# Altium project Power Distribution Unit 2019.PrjPCB (part 2 of 2)

## Sheet LowCurrentSwitches.SchDoc
size A4
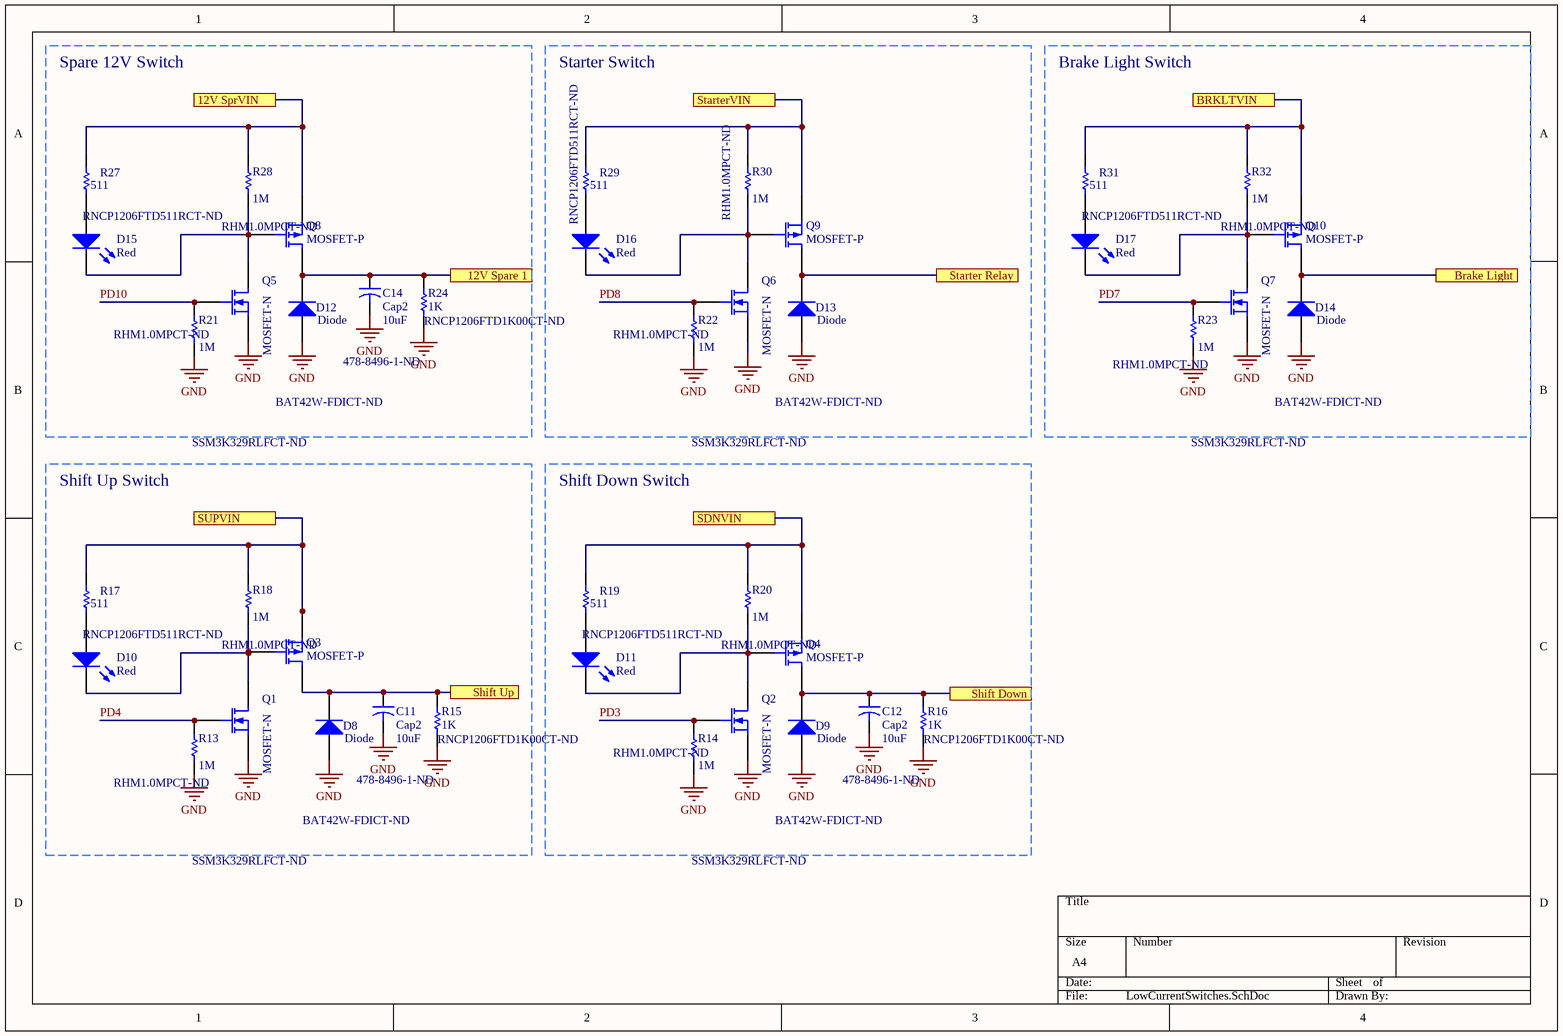
[diagram p2: LowCurrentSwitches.SchDoc]

### Parts
C11  Cap2  value 10uF  Supplier Part Number: 478-8496-1-ND  [PolCap1206]
C12  Cap2  value 10uF  Supplier Part Number: 478-8496-1-ND  [PolCap1206]
C14  Cap2  value 10uF  Supplier Part Number: 478-8496-1-ND  [PolCap1206]
D8  Diode  Supplier Part Number: BAT42W-FDICT-ND  [SOD123]
D9  Diode  Supplier Part Number: BAT42W-FDICT-ND  [SOD123]
D10  Red  [LEDC3216X120NRED]
D11  Red  [LEDC3216X120NRED]
D12  Diode  Supplier Part Number: BAT42W-FDICT-ND  [SOD123]
D13  Diode  Supplier Part Number: BAT42W-FDICT-ND  [SOD123]
D14  Diode  Supplier Part Number: BAT42W-FDICT-ND  [SOD123]
D15  Red  [LEDC3216X120NRED]
D16  Red  [LEDC3216X120NRED]
D17  Red  [LEDC3216X120NRED]
Q1  MOSFET-N  Supplier Part Number: SSM3K329RLFCT-ND  [SOT23-3]
Q2  MOSFET-N  Supplier Part Number: SSM3K329RLFCT-ND  [SOT23-3]
Q3  MOSFET-P  [SOT23-3]
Q4  MOSFET-P  [SOT23-3]
Q5  MOSFET-N  Supplier Part Number: SSM3K329RLFCT-ND  [SOT23-3]
Q6  MOSFET-N  Supplier Part Number: SSM3K329RLFCT-ND  [SOT23-3]
Q7  MOSFET-N  Supplier Part Number: SSM3K329RLFCT-ND  [SOT23-3]
Q8  MOSFET-P  [SOT23-3]
Q9  MOSFET-P  [SOT23-3]
Q10  MOSFET-P  [SOT23-3]
R13  value 1M  Supplier Part Number: RHM1.0MPCT-ND  [RESC3216X60N]  (hidden comment: 1206)
R14  value 1M  Supplier Part Number 1: RHM1.0MPCT-ND  [RESC3216X60N]  (hidden comment: 1206)
R15  1K  Supplier Part Number: RNCP1206FTD1K00CT-ND  [RESC3216X60N]
R16  1K  Supplier Part Number: RNCP1206FTD1K00CT-ND  [RESC3216X60N]
R17  511  Supplier Part Number: RNCP1206FTD511RCT-ND  [RESC3216X60N]
R18  value 1M  Supplier Part Number: RHM1.0MPCT-ND  [RESC3216X60N]  (hidden comment: 1206)
R19  511  Supplier Part Number: RNCP1206FTD511RCT-ND  [RESC3216X60N]
R20  value 1M  Supplier Part Number: RHM1.0MPCT-ND  [RESC3216X60N]  (hidden comment: 1206)
R21  value 1M  Supplier Part Number 1: RHM1.0MPCT-ND  [RESC3216X60N]  (hidden comment: 1206)
R22  value 1M  Supplier Part Number 1: RHM1.0MPCT-ND  [RESC3216X60N]  (hidden comment: 1206)
R23  value 1M  Supplier Part Number: RHM1.0MPCT-ND  [RESC3216X60N]  (hidden comment: 1206)
R24  1K  Supplier Part Number: RNCP1206FTD1K00CT-ND  [RESC3216X60N]
R27  511  Supplier Part Number: RNCP1206FTD511RCT-ND  [RESC3216X60N]
R28  value 1M  Supplier Part Number: RHM1.0MPCT-ND  [RESC3216X60N]  (hidden comment: 1206)
R29  511  Supplier Part Number: RNCP1206FTD511RCT-ND  [RESC3216X60N]
R30  value 1M  Supplier Part Number 1: RHM1.0MPCT-ND  [RESC3216X60N]  (hidden comment: 1206)
R31  511  Supplier Part Number: RNCP1206FTD511RCT-ND  [RESC3216X60N]
R32  value 1M  Supplier Part Number: RHM1.0MPCT-ND  [RESC3216X60N]  (hidden comment: 1206)

### Blocks framed on the sheet
Spare 12V Switch: C14 D12 D15 Q5 Q8 R21 R24 R27 R28
Starter Switch: D13 D16 Q6 Q9 R22 R29 R30
Brake Light Switch: D14 D17 Q7 Q10 R23 R31 R32
Shift Up Switch: C11 D8 D10 Q1 Q3 R13 R15 R17 R18
Shift Down Switch: C12 D9 D11 Q2 Q4 R14 R16 R19 R20

### Ports
12V Spare 1, 12V SprVIN, Brake Light, BRKLTVIN, SDNVIN, Shift Down, Shift Up, Starter Relay, StarterVIN, SUPVIN

### Nets
GND: C11.2 C12.2 C14.2 D8.1(A) D9.1(A) D12.1(A) D13.1(A) D14.1(A) Q1.3(S) Q2.3(S) Q5.3(S) Q6.3(S) Q7.3(S) R13.1 R14.1 R15.1 R16.1 R21.1 R22.1 R23.1 R24.1
PD3: Q2.2(G) R14.2
PD4: Q1.2(G) R13.2
PD7: Q7.2(G) R23.2
PD8: Q6.2(G) R22.2
PD10: Q5.2(G) R21.2
Net12VSpr1_1: Q8.3(S) R27.1 R28.2 ; port 12V SprVIN
NetBRKLTVIN_1: Q10.3(S) R31.1 R32.2 ; port BRKLTVIN
NetC11_1: C11.1 D8.2(K) Q3.1(D) R15.2 ; port Shift Up
NetC12_1: C12.1 D9.2(K) Q4.1(D) R16.2 ; port Shift Down
NetC14_1: C14.1 D12.2(K) Q8.1(D) R24.2 ; port 12V Spare 1
NetD10_1: D10.1(A) R17.2
NetD10_2: D10.2(K) Q1.1(D) Q3.2(G) R18.1
NetD11_1: D11.1(A) R19.2
NetD11_2: D11.2(K) Q2.1(D) Q4.2(G) R20.1
NetD13_2: D13.2(K) Q9.1(D) ; port Starter Relay
NetD14_2: D14.2(K) Q10.1(D) ; port Brake Light
NetD15_1: D15.1(A) R27.2
NetD15_2: D15.2(K) Q5.1(D) Q8.2(G) R28.1
NetD16_1: D16.1(A) R29.2
NetD16_2: D16.2(K) Q6.1(D) Q9.2(G) R30.1
NetD17_1: D17.1(A) R31.2
NetD17_2: D17.2(K) Q7.1(D) Q10.2(G) R32.1
NetQ3_3: Q3.3(S) Q4.3(S) R17.1 R18.2 R19.1 R20.2 ; port SUPVIN, port SDNVIN
NetQ9_3: Q9.3(S) R29.1 R30.2 ; port StarterVIN

### Library data of the parts
C11 C12 C14 = Cap2: Capacitor. Ceramic 10uF 50V rating recommended, place close to pin; Published: 23-Sep-2002; PackageReference: CAPR5-4X5; Publisher: Altium Limited; PackageDescription: Capacitor; 2 Leads; Supplier 1: Digi-Key
D8 D9 D12-D14 = Diode: Default Diode; Published: 8-Jun-2000; LatestRevisionDate: 17-Jul-2002; LatestRevisionNote: Re-released for DXP Platform.; PackageVersion: Sep-1996; PackageReference: SMC; Publisher: Altium Limited; PackageDescription: DO-214-AB/SMC; 2 C-Bend Leads; Body 7.9 x 5.9 mm, inc. leads (LxW); Code_JEDEC: DO-214-AB; Supplier 1: Digi-Key
D10 D11 D15-D17 = LED2_2: Typical RED, GREEN, YELLOW, AMBER GaAs LED; Manufacturer: Broadcom Avago; Manufacturer Part Number: HSMY-C150; Lens Colour: White,Clear; Viewing Angle: 170°; Lens Style: Diffused,Colorless,Rectangular; Wavelength: 586nm; Luminous Intensity: 8mcd; Forward Current: 20mA; Forward Voltage: 2.1V; Number of LEDs: 1; Reverse Voltage: 5V; Power Dissipation: 65mW; Lens Transparency: Diffused; Published: 8-Jun-2000; LatestRevisionDate: 17-Jul-2002; LatestRevisionNote: Re-released for DXP Platform.; PackageVersion: Feb-2002; PackageReference: 3.2X1.6X1.1; Publisher: Altium Limited; PackageDescription: SM LED; 2 Flat Leads; Supplier 1: Digi-Key; Stock 1: 0; Mount: Surface Mount; Case/Package: 1206; Number of Pins: 2; Colour: Red; Case Code (Metric): 3216; Case Code (Imperial): 1206; Contact Plating: Gold; Min Operating Temperature: -40°C; Max Operating Temperature: 85°C; Packaging: Tape and Reel; Package Quantity: 1; Illumination Colour: Red; Dominant Wavelength: 586nm; Test Current: 20mA; Number of Elements: 1; Power Rating: 65mW; Max Power Dissipation: 65mW; Voltage Rating (DC): 2.1V; Length: 3.2mm; Height: 1.1mm; Width: 1.6mm; Depth: 1.6mm; Radiation Hardening: No; REACH SVHC: No SVHC; Lead Free: Lead Free; ComponentLink1URL: https://datasheet.ciiva.com/15117/getdatasheetpartid-110528-15117488.pdf; ComponentLink1Description: https://datasheet.ciiva.com/15117/getdatasheetpartid-110528-15117488.pdf; ComponentLink2URL: https://datasheet.ciiva.com/11774/0900766b804a6539-11774578.pdf; ComponentLink2Description: https://datasheet.ciiva.com/11774/0900766b804a6539-11774578.pdf; ComponentLink3URL: https://datasheet.ciiva.com/19466/1557071-19466435.pdf; ComponentLink3Description: https://datasheet.ciiva.com/19466/1557071-19466435.pdf; ComponentLink4URL: https://datasheet.ciiva.com/14172/swseriehsmx-c150toc190-e-14172159.pdf; ComponentLink4Description: https://datasheet.ciiva.com/14172/swseriehsmx-c150toc190-e-14172159.pdf; ComponentLink5URL: https://datasheet.ciiva.com/29280/180507-da-01-en-chip-led-hsmy-c150-gelb-29280997.pdf; ComponentLink5Description: https://datasheet.ciiva.com/29280/180507-da-01-en-chip-led-hsmy-c150-gelb-29280997.pdf; Supplier 2: Digi-Key; Stock 2: 0; ComponentLink6URL: https://datasheet.ciiva.com/11773/0900766b804a6539-11773956.pdf; ComponentLink6Description: https://datasheet.ciiva.com/11773/0900766b804a6539-11773956.pdf; ComponentLink7URL: https://datasheet.ciiva.com/15117/getdatasheetpartid-142358-15117749.pdf; ComponentLink7Description: https://datasheet.ciiva.com/15117/getdatasheetpartid-142358-15117749.pdf; ComponentLink8URL: https://datasheet.ciiva.com/46426/313031-46426533.pdf; ComponentLink8Description: https://datasheet.ciiva.com/46426/313031-46426533.pdf; ComponentLink9URL: https://datasheet.ciiva.com/14172/swseriehsmx-c150toc190-e-14172156.pdf; ComponentLink9Description: https://datasheet.ciiva.com/14172/swseriehsmx-c150toc190-e-14172156.pdf; ComponentLink10URL: https://datasheet.ciiva.com/29281/180509-da-01-en-chip-led-hsmh-c150-rot-29281009.pdf; ComponentLink10Description: https://datasheet.ciiva.com/29281/180509-da-01-en-chip-led-hsmh-c150-rot-29281009.pdf; Supplier 3: Digi-Key; Supplier 4: Digi-Key; Supplier Part Number: 732-4992-1-ND
Q1 Q2 Q5-Q7 = MOSFET-N: N-Channel MOSFET; Published: 8-Jun-2000; LatestRevisionDate: 17-Jul-2002; LatestRevisionNote: Re-released for DXP Platform.; PackageVersion: 1995/1996; PackageReference: E3; Publisher: Altium Limited; PackageDescription: TO, Flat Index; 3 In-Line, Axial Leads; Body Dia. 4.6mm; Lead Dia. 0.5 mm (max); Supplier 1: Digi-Key
Q3 Q4 Q8-Q10 = MOSFET-P: P-Channel MOSFET; Published: 8-Jun-2000; LatestRevisionDate: 17-Jul-2002; LatestRevisionNote: Re-released for DXP Platform.; PackageVersion: 1995/1996; PackageReference: E3; Publisher: Altium Limited; PackageDescription: TO, Flat Index; 3 In-Line, Axial Leads; Body Dia. 4.6mm; Lead Dia. 0.5 mm (max); Supplier 1: Digi-Key; Supplier Part Number: DMP3099L-7DICT-ND
R13 R14 R17-R23 R27-R32 = Res1: Resistor; Published: 8-Jun-2000; LatestRevisionDate: 17-Jul-2002; LatestRevisionNote: Re-released for DXP Platform.; PackageReference: AXIAL-0.3; Publisher: Altium Limited; PackageDescription: Axial Device, Thru-Hole; 2 Leads; 0.3 in Pin Spacing; Supplier 1: Digi-Key
  R17 R19 R27 R29 R31: Value: 511
  R21 R30: Supplier Part Number: RHM1.0MPCT-ND
R15 R16 R24 = Res1: Resistor; Manufacturer: Stackpole Electronics; Manufacturer Part Number: RNCP1206FTD1K00; Resistance: 10kR; Tolerance: 1%; Temperature Coefficient: 100ppm/°C; Max Power Dissipation: 500mW; Value: 1K; Supplier 1: Digi-Key; Stock 1: 679; Pricing 1: 1=0.1, 10=0.052, 100=0.0211, 1000=0.00949, 2500=0.00824 (USD); Mount: Surface Mount; Case/Package: 1206; Case Code (Metric): 3216; Case Code (Imperial): 1206; Contact Plating: Nickel,Tin,Matte; Min Operating Temperature: -55°C; Max Operating Temperature: 155°C; Packaging: Tape and Reel; Composition: Thin Film; Number of Terminations: 2; Length: 0.122inch; Height: 0.024inch; Width: 0.059inch; Radiation Hardening: No; Lead Free: Lead Free; ComponentLink1URL: http://www.seielect.com/Catalog/SEI-rncp.pdf; ComponentLink1Description: http://www.seielect.com/Catalog/SEI-rncp.pdf; ComponentLink2URL: https://www.seielect.com/catalog/SEI-Packaging.pdf; ComponentLink2Description: https://www.seielect.com/catalog/SEI-Packaging.pdf

## Sheet HighCurrentSwitches.SchDoc
size A
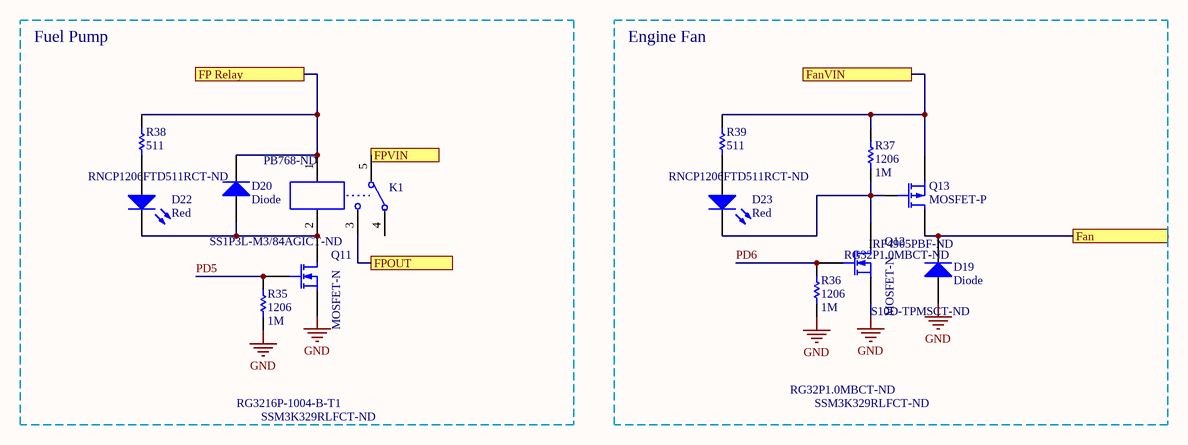
[diagram p3: HighCurrentSwitches.SchDoc]

### Parts
D19  Diode  Supplier Part Number: S10D-TPMSCT-ND  [SMC]
D20  Diode  Supplier Part Number: SS1P3L-M3/84AGICT-ND  [DO-220AA]
D22  Red  [LEDC3216X120NRED]
D23  Red  [LEDC3216X120NRED]
K1  Supplier Part Number: PB768-ND  [TECO-PB134-5_V]  (hidden comment: PB134012)
Q11  MOSFET-N  Supplier Part Number: SSM3K329RLFCT-ND  [SOT23-3]
Q12  MOSFET-N  Supplier Part Number: SSM3K329RLFCT-ND  [SOT23-3]
Q13  MOSFET-P  Supplier Part Number: IRF4905PBF-ND  [TO-220AB]
R35  1206  value 1M  Supplier Part Number: RG3216P-1004-B-T1  [RESC3216X60N]
R36  1206  value 1M  Supplier Part Number: RG32P1.0MBCT-ND  [RESC3216X60N]
R37  1206  value 1M  Supplier Part Number: RG32P1.0MBCT-ND  [RESC3216X60N]
R38  511  Supplier Part Number: RNCP1206FTD511RCT-ND  [RESC3216X60N]
R39  511  Supplier Part Number: RNCP1206FTD511RCT-ND  [RESC3216X60N]

### Blocks framed on the sheet
Fuel Pump: D20 D22 K1 Q11 R35 R38
Engine Fan: D19 D23 Q12 Q13 R36 R37 R39

### Ports
Fan, FanVIN, FP Relay, FPOUT, FPVIN

### Nets
GND: D19.1(A) Q11.3(S) Q12.3(S) R35.1 R36.1
PD5: Q11.2(G) R35.2
PD6: Q12.2(G) R36.2
NetD19_2: D19.2(K) Q13.2(D) ; port Fan
NetD20_1: D20.1(A) D22.2(K) K1.2(A2) Q11.1(D)
NetD20_2: D20.2(K) K1.1(A1) R38.1 ; port FP Relay
NetD22_1: D22.1(A) R38.2
NetD23_1: D23.1(A) R39.2
NetD23_2: D23.2(K) Q12.1(D) Q13.1(G) R37.1
NetK1_3: K1.3 ; port FPOUT
NetK1_5: K1.5 ; port FPVIN
NetP6_8: Q13.3(S) R37.2 R39.1 ; port FanVIN

Not connected (* = marked no-connect by the designer): K1 4(12)

### Library data of the parts
D19 = Diode: Default Diode; Published: 8-Jun-2000; LatestRevisionDate: 17-Jul-2002; LatestRevisionNote: Re-released for DXP Platform.; PackageVersion: Sep-1996; PackageReference: SMC; Publisher: Altium Limited; PackageDescription: DO-214-AB/SMC; 2 C-Bend Leads; Body 7.9 x 5.9 mm, inc. leads (LxW); Code_JEDEC: DO-214-AB; Supplier 1: Digi-Key
D20 = Diode: Switching diode; Published: 8-Jun-2000; LatestRevisionDate: 17-Jul-2002; LatestRevisionNote: Re-released for DXP Platform.; PackageVersion: Sep-1996; PackageReference: SMC; Publisher: Altium Limited; PackageDescription: DO-214-AB/SMC; 2 C-Bend Leads; Body 7.9 x 5.9 mm, inc. leads (LxW); Code_JEDEC: DO-214-AB; Supplier 1: Digi-Key
D22 D23 = LED2_2: as D10 on sheet LowCurrentSwitches; Published: 8-Jun-2000; LatestRevisionDate: 17-Jul-2002; LatestRevisionNote: Re-released for DXP Platform.; PackageVersion: Feb-2002; PackageReference: 3.2X1.6X1.1; Publisher: Altium Limited; PackageDescription: SM LED; 2 Flat Leads; Supplier 1: Digi-Key; Stock 1: 0; Mount: Surface Mount; Case/Package: 1206; Number of Pins: 2; Colour: Yellow; Case Code (Metric): 3216; Case Code (Imperial): 1206; Contact Plating: Gold; Min Operating Temperature: -40°C; Max Operating Temperature: 85°C; Packaging: Tape and Reel; Package Quantity: 1; Illumination Colour: Yellow; Dominant Wavelength: 586nm; Test Current: 20mA; Number of Elements: 1; Power Rating: 65mW; Max Power Dissipation: 65mW; Voltage Rating (DC): 2.1V; Length: 3.2mm; Height: 1.1mm; Width: 1.6mm; Depth: 1.6mm; Radiation Hardening: No; REACH SVHC: No SVHC; Lead Free: Lead Free; ComponentLink1URL: https://datasheet.ciiva.com/15117/getdatasheetpartid-110528-15117488.pdf; ComponentLink1Description: https://datasheet.ciiva.com/15117/getdatasheetpartid-110528-15117488.pdf; ComponentLink2URL: https://datasheet.ciiva.com/11774/0900766b804a6539-11774578.pdf; ComponentLink2Description: https://datasheet.ciiva.com/11774/0900766b804a6539-11774578.pdf; ComponentLink3URL: https://datasheet.ciiva.com/19466/1557071-19466435.pdf; ComponentLink3Description: https://datasheet.ciiva.com/19466/1557071-19466435.pdf; ComponentLink4URL: https://datasheet.ciiva.com/14172/swseriehsmx-c150toc190-e-14172159.pdf; ComponentLink4Description: https://datasheet.ciiva.com/14172/swseriehsmx-c150toc190-e-14172159.pdf; ComponentLink5URL: https://datasheet.ciiva.com/29280/180507-da-01-en-chip-led-hsmy-c150-gelb-29280997.pdf; ComponentLink5Description: https://datasheet.ciiva.com/29280/180507-da-01-en-chip-led-hsmy-c150-gelb-29280997.pdf; Supplier 2: Digi-Key; Stock 2: 0; ComponentLink6URL: https://datasheet.ciiva.com/11773/0900766b804a6539-11773956.pdf; ComponentLink6Description: https://datasheet.ciiva.com/11773/0900766b804a6539-11773956.pdf; ComponentLink7URL: https://datasheet.ciiva.com/15117/getdatasheetpartid-142358-15117749.pdf; ComponentLink7Description: https://datasheet.ciiva.com/15117/getdatasheetpartid-142358-15117749.pdf; ComponentLink8URL: https://datasheet.ciiva.com/46426/313031-46426533.pdf; ComponentLink8Description: https://datasheet.ciiva.com/46426/313031-46426533.pdf; ComponentLink9URL: https://datasheet.ciiva.com/14172/swseriehsmx-c150toc190-e-14172156.pdf; ComponentLink9Description: https://datasheet.ciiva.com/14172/swseriehsmx-c150toc190-e-14172156.pdf; ComponentLink10URL: https://datasheet.ciiva.com/29281/180509-da-01-en-chip-led-hsmh-c150-rot-29281009.pdf; ComponentLink10Description: https://datasheet.ciiva.com/29281/180509-da-01-en-chip-led-hsmh-c150-rot-29281009.pdf; Supplier 3: Digi-Key; Supplier 4: Digi-Key; Supplier Part Number: 732-4992-1-ND
K1 = PB134012: Miniature Power PCB Relay PB, 1 Form A Contact, 12 V, 10 A, 360 mW, Standard Version, -40 to 85 degC, 5-Pin 15 x 15 x 20 mm THD, RoHS, Tube; Contact Form: 1 Form A (SPST-NO); Contact Current Rating: 10 A; Coil Resistance: 400 Ohms; Coil Voltage: 24 V; DatasheetVersion: Rev. 0411; PackageReference: THD; Supplier 1: Newark; Supplier Part Number 1: 15AC8464; Supplier 2: Farnell; Supplier Part Number 2: 2748039; Supplier 3: Digi-Key; Contact Material: Silver Nickel; Mounting Style: Through Hole; Mounting Technology: Through Hole; ComponentLink1Description: Manufacturer URL; ComponentLink1URL: http://www.te.com; ComponentLink2Description: Datasheet; ComponentLink2URL: http://www.te.com/commerce/DocumentDelivery/DDEController?Action=showdoc&DocId=Data+Sheet%7FPB%7F0411%7Fpdf%7FEnglish%7FENG_DS_PB_0411.pdf%7F2-1415030-1
Q11 Q12 = MOSFET-N: N-Channel MOSFET; Published: 8-Jun-2000; LatestRevisionDate: 17-Jul-2002; LatestRevisionNote: Re-released for DXP Platform.; PackageVersion: 1995/1996; PackageReference: E3; Publisher: Altium Limited; PackageDescription: TO, Flat Index; 3 In-Line, Axial Leads; Body Dia. 4.6mm; Lead Dia. 0.5 mm (max); Supplier 1: Digi-Key
Q13 = MOSFET-P: P-Channel MOSFET; Published: 8-Jun-2000; LatestRevisionDate: 17-Jul-2002; LatestRevisionNote: Re-released for DXP Platform.; PackageVersion: 1995/1996; PackageReference: E3; Publisher: Altium Limited; PackageDescription: TO, Flat Index; 3 In-Line, Axial Leads; Body Dia. 4.6mm; Lead Dia. 0.5 mm (max); Supplier 1: Digi-Key
R35-R39 = Res1: Resistor; Published: 8-Jun-2000; LatestRevisionDate: 17-Jul-2002; LatestRevisionNote: Re-released for DXP Platform.; PackageReference: AXIAL-0.3; Publisher: Altium Limited; PackageDescription: Axial Device, Thru-Hole; 2 Leads; 0.3 in Pin Spacing; Supplier 1: Digi-Key
  R38 R39: Value: 511

## Sheet ResetCircuit.SchDoc
size A4
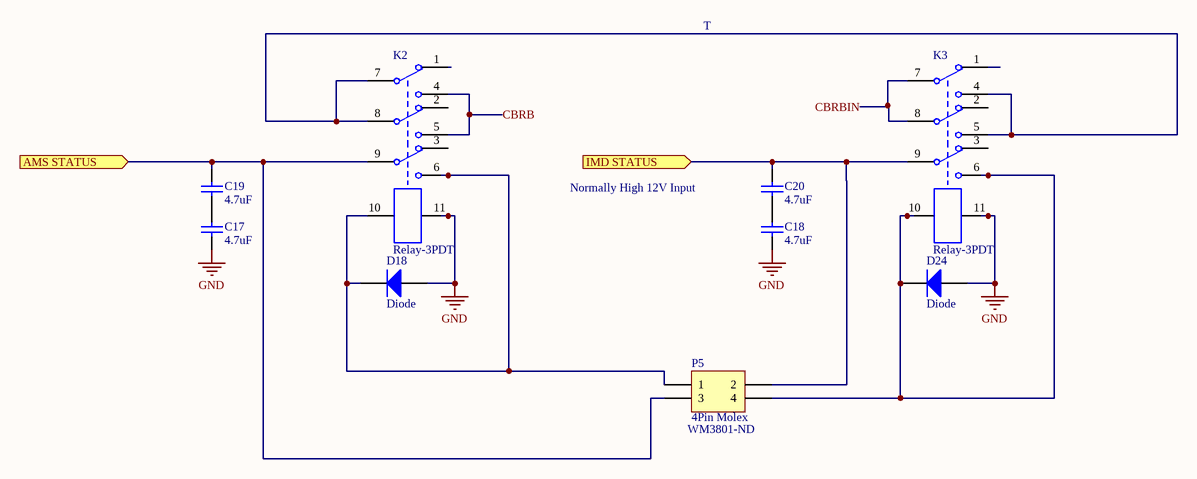
[diagram p4: ResetCircuit.SchDoc]

### Parts
C17  4.7uF  [CAPC3216X170N]
C18  4.7uF  [CAPC3216X170N]
C19  4.7uF  [CAPC3216X170N]
C20  4.7uF  [CAPC3216X170N]
D18  Diode  [DO-220AA]
D24  Diode  [DO-220AA]
K2  Relay-3PDT  [55.13]
K3  Relay-3PDT  [55.13]
P5  4Pin Molex  Supplier Part Number: WM3801-ND  [4Pin Molex]

### Ports
AMS STATUS (in), IMD STATUS (in)

### Nets
GND: C17.1 C18.1 D18.1(A) D24.1(A) K2.11 K3.11
CBRB: K2.4 K2.5
CBRBIN: K3.7 K3.8
NetC17_2: C17.2 C19.1
NetC18_2: C18.2 C20.1
NetC19_2: C19.2 K2.9 P5.3 ; port AMS STATUS
NetC20_2: C20.2 K3.9 P5.2 ; port IMD STATUS
NetD18_2: D18.2(K) K2.6 K2.10 P5.1
NetD24_2: D24.2(K) K3.6 K3.10 P5.4
NetK2_7: K2.7 K2.8 K3.4 K3.5

Not connected (* = marked no-connect by the designer): K2 1 2 3; K3 1 2 3

### Notes on the sheet
- T
- Normally High 12V Input

### Library data of the parts
C17-C20 = Cap Semi: Capacitor (Semiconductor SIM Model); Manufacturer: Murata; Manufacturer Part Number: GRM31MR71H105KA88L; Material: Ceramic; Tolerance: 10%; Voltage Rating: 50V; Capacitance: 1uF; Dielectric: X7R; Published: 8-Jun-2000; LatestRevisionDate: 29-May-2009; LatestRevisionNote: IPC-7351 Footprint Added.; PackageReference: C1206; Publisher: Altium Limited; PackageDescription: Chip Capacitor; Value: 4.7uF; Supplier Part Number: 1276-1055-1-ND; Supplier 1: Digi-Key; Stock 1: 0; Mount: Surface Mount; Case/Package: 1206; Number of Pins: 2; Case Code (Metric): 3216; Case Code (Imperial): 1206; Min Operating Temperature: -55°C; Max Operating Temperature: 125°C; Package Quantity: 1; Packaging: Tape and Reel; Voltage Rating (DC): 50V; Termination: SMD/SMT; Voltage: 50V; Length: 3.2mm; Height: 1.15mm; Width: 0.063inch; Thickness: 0.049inch; Depth: 1.6mm; REACH SVHC: No SVHC; Lead Free: Lead Free; ComponentLink1URL: https://datasheet.ciiva.com/16379/product-16379616.pdf; ComponentLink1Description: https://datasheet.ciiva.com/16379/product-16379616.pdf; ComponentLink2URL: https://datasheet.ciiva.com/14116/nmgrm-data-en-14116709.pdf; ComponentLink2Description: https://datasheet.ciiva.com/14116/nmgrm-data-en-14116709.pdf; ComponentLink3URL: https://datasheet.ciiva.com/22703/608985-22703384.pdf; ComponentLink3Description: https://datasheet.ciiva.com/22703/608985-22703384.pdf; ComponentLink4URL: https://datasheet.ciiva.com/3777/42grm31mr71h105ka8823-3777081.pdf; ComponentLink4Description: https://datasheet.ciiva.com/3777/42grm31mr71h105ka8823-3777081.pdf; ComponentLink5URL: https://datasheet.ciiva.com/6270/partnumbering-e-01-6270398.pdf; ComponentLink5Description: https://datasheet.ciiva.com/6270/partnumbering-e-01-6270398.pdf; ComponentLink6URL: https://datasheet.ciiva.com/6270/partnumbering-e-01-6270399.pdf; ComponentLink6Description: https://datasheet.ciiva.com/6270/partnumbering-e-01-6270399.pdf; ComponentLink7URL: https://datasheet.ciiva.com/29199/455056-da-01-en-vs-kondensator-1206-29199449.pdf; ComponentLink7Description: https://datasheet.ciiva.com/29199/455056-da-01-en-vs-kondensator-1206-29199449.pdf; ComponentLink8URL: https://datasheet.ciiva.com/29202/450923-da-01-de-vs-chip-kond-1206-1-0-uf-10pr-50-0v-x7r-29202718.pdf; ComponentLink8Description: https://datasheet.ciiva.com/29202/450923-da-01-de-vs-chip-kond-1206-1-0-uf-10pr-50-0v-x7r-29202718.pdf; Supplier 2: Digi-Key
D18 D24 = Diode: Default Diode; Published: 8-Jun-2000; LatestRevisionDate: 17-Jul-2002; LatestRevisionNote: Re-released for DXP Platform.; PackageVersion: Sep-1996; PackageReference: SMC; Publisher: Altium Limited; PackageDescription: DO-214-AB/SMC; 2 C-Bend Leads; Body 7.9 x 5.9 mm, inc. leads (LxW); Code_JEDEC: DO-214-AB; Supplier 1: Digi-Key; Supplier 2: Digi-Key; Supplier Part Number: SS1P3L-M3/84AGICT-ND
K2 K3 = Relay-3PDT: ComponentLink1Description: Manufacturer Link; ComponentLink2Description: Datasheet

## Nets that join several sheets
GND: Candunio (28 pins), Fusing (8 pins), LowCurrentSwitches (21 pins), HighCurrentSwitches (5 pins), ResetCircuit (6 pins)
CANH: Candunio (P3.1 R8.1 U3.7), Fusing (P4.20)
CANL: Candunio (P3.2 R8.2 U3.6), Fusing (P4.10)
CBRB: Fusing (8 pins), ResetCircuit (K2.4 K2.5)
CBRBIN: Fusing (P6.9 P6.19), ResetCircuit (K3.7 K3.8)
Net12VSpr1_1: Fusing (12VSpr1.1), LowCurrentSwitches (Q8.3 R27.1 R28.2)
NetBRKLTVIN_1: Fusing (BRKLTVIN.1), LowCurrentSwitches (Q10.3 R31.1 R32.2)
NetC11_1: Fusing (P6.13), LowCurrentSwitches (C11.1 D8.2 Q3.1 R15.2)
NetC12_1: Fusing (P6.17), LowCurrentSwitches (C12.1 D9.2 Q4.1 R16.2)
NetC14_1: Fusing (P6.7), LowCurrentSwitches (C14.1 D12.2 Q8.1 R24.2)
NetC19_2: Candunio (R34.2), Fusing (P6.15), ResetCircuit (C19.2 K2.9 P5.3)
NetC20_2: Candunio (R33.2), Fusing (P6.16), ResetCircuit (C20.2 K3.9 P5.2)
NetCntrllr_2: Candunio (D21.1), Fusing (Cntrllr.2)
NetD13_2: Fusing (P4.14), LowCurrentSwitches (D13.2 Q9.1)
NetD14_2: Fusing (P6.2), LowCurrentSwitches (D14.2 Q10.1)
NetD19_2: Fusing (P6.6), HighCurrentSwitches (D19.2 Q13.2)
NetK1_3: Fusing (P6.4), HighCurrentSwitches (K1.3)
NetK1_5: Fusing (P6.3), HighCurrentSwitches (K1.5)
NetP6_8: Fusing (P6.8), HighCurrentSwitches (Q13.3 R37.2 R39.1)
NetQ3_3: Fusing (Shft.2), LowCurrentSwitches (6 pins)
NetQ9_3: Fusing (Strt.2), LowCurrentSwitches (Q9.3 R29.1 R30.2)
PD3: Candunio (U1.1), LowCurrentSwitches (Q2.2 R14.2)
PD4: Candunio (U1.2), LowCurrentSwitches (Q1.2 R13.2)
PD5: Candunio (U1.9), HighCurrentSwitches (Q11.2 R35.2)
PD6: Candunio (U1.10), HighCurrentSwitches (Q12.2 R36.2)
PD7: Candunio (U1.11), LowCurrentSwitches (Q7.2 R23.2)
PD8: Candunio (U1.12), LowCurrentSwitches (Q6.2 R22.2)
PD10: Candunio (U1.14), LowCurrentSwitches (Q5.2 R21.2)